# EAGLE design i2c_master_v2 (EAGLE 6.2)
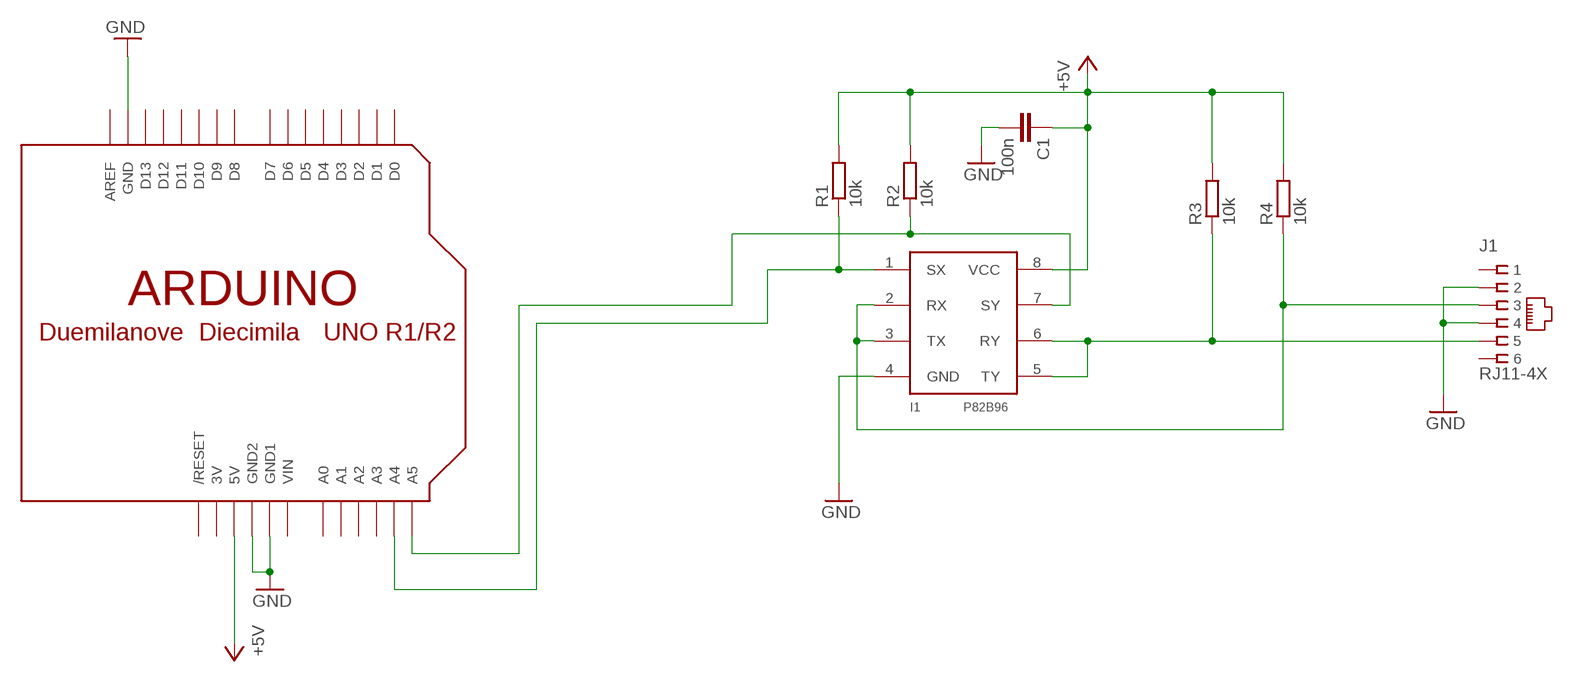
[diagram p0: schematic, sheet 1]

## Parts
C1  100n  C-EUC1206  [C1206]
I1  P82B96  [SOIC8]
J1  RJ11-4X  [RJ11-NO_SHIELD]
R1  10k  R-EU_M1206  [M1206]
R2  10k  R-EU_M1206  [M1206]
R3  10k  R-EU_M1206  [M1206]
R4  10k  R-EU_M1206  [M1206]
U$1  ARDUINO-NOHOLE  [ARDUINO-NOHOLE]

## Nets
+5V: C1.1 I1.8(VCC) R1.2 R2.2 R3.2 R4.2 U$1.5V
GND: C1.2 I1.4(GND) J1.2 J1.4 U$1.GND U$1.GND1 U$1.GND2
N$1: I1.7(SY) R2.1 U$1.A5
N$2: I1.1(SX) R1.1 U$1.A4
N$3: I1.5(TY) I1.6(RY) J1.5 R3.1
N$4: I1.2(RX) I1.3(TX) J1.3 R4.1
Unconnected: J1.1 J1.6 U$1.A0 U$1.A1 U$1.A2 U$1.A3 U$1.AREF U$1.D0 U$1.D1 U$1.D2 U$1.D3 U$1.D4 U$1.D5 U$1.D6 U$1.D7 U$1.D8 U$1.D9 U$1.D10 U$1.D11 U$1.D12 U$1.D13 U$1.RESET(/RESET)

## Power pins joined to a net without a drawn wire
3V: U$1.3V
VIN: U$1.VIN

## Library data of the parts
C1 = resistor:C-EU: CAPACITOR, European symbol
I1 = P82B96:P82B96: P82B96 - I2C buffer
J1 = con-tycoelectronics:RJ11: CORCOM Modular RJ Jacks No Shield Source: www.tycoelectronics.com .. ENG_DS_1654001_1099_RJ_L_0507.pdf; MPN: 6609214-3; OC_FARNELL: unknown; OC_NEWARK: 19R7022
R1-R4 = resistor:R-EU_: RESISTOR, European symbol
U$1 = adafruit:ARDUINO: Arduino Diecimila/Duemilanove Make a shield with ease, this package has all the named pins as well as the two mounting drill holes and an outline of the USB and DC power connector. The outline is on the DIMENSION layer, so if your board house uses it they will cut the outline to match. http://www.ladyada.net/library/pcb/eaglelibrary.html

## Board
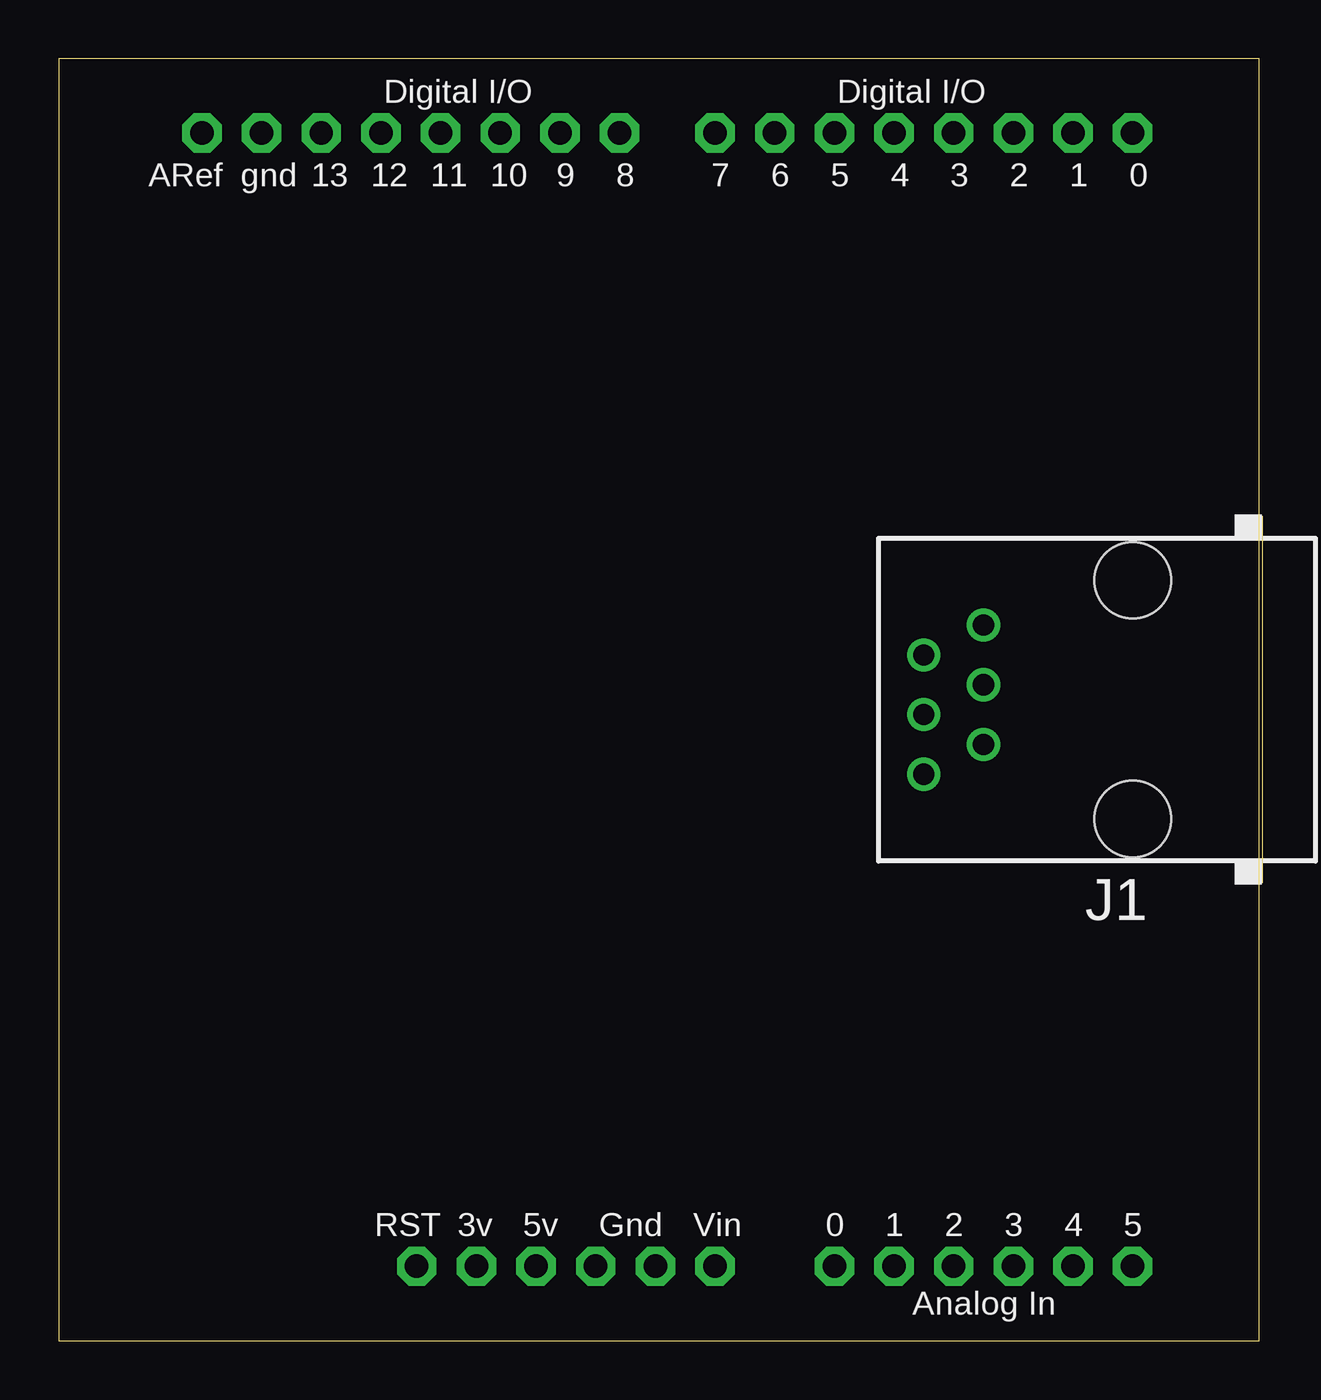
[diagram p1: board, top side]
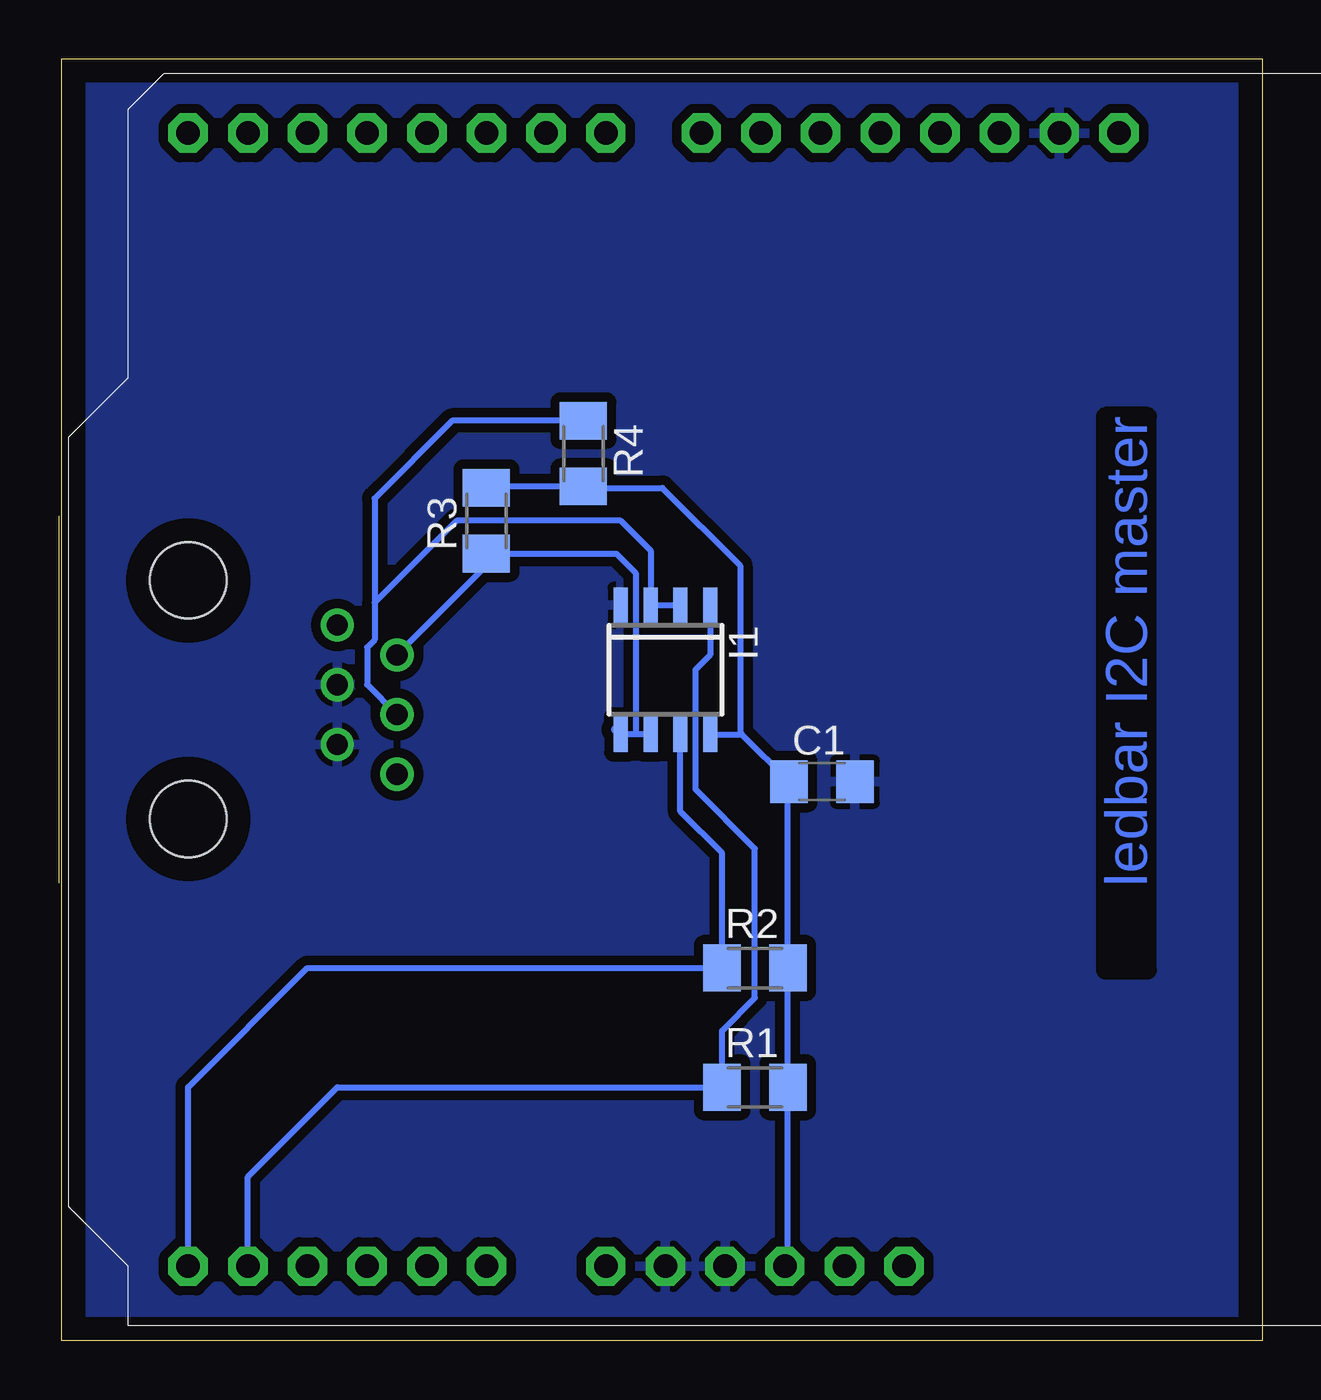
[diagram p2: board, bottom side, seen from below]

Size 51.11 x 54.6 mm. Coordinates in mm from the lower left corner, seen from the top.
Outline: 0,0 51.11,0 51.11,54.6 0,54.6 0,0
Copper layers (1*16): Top 0.035mm / dielectric 1.5mm / Bottom 0.035mm
Design rules: minimum track width 10mil, minimum drill 24mil, track to track 16mil, track to pad 16mil, pad to pad 16mil, via to via 16mil, smd to smd 8mil, copper to edge 40mil, drill to drill 8mil, minimum pad ring 10mil, minimum via ring 8mil, stop-mask expansion 4mil, vias tented up to drill 0mil, thermal gap 10mil

### Footprints (pad centres in the part's own frame; a part is rotated, then mirrored left to right if it is on the bottom)
C1206 = smd 1.6 x 1.8: 1 -1.4,0; 2 1.4,0
SOIC8 = smd 0.6 x 1.5: 1 -1.905,-2.75; 2 -0.635,-2.75; 3 0.635,-2.75; 4 1.905,-2.75; 5 1.905,2.75; 6 0.635,2.75; 7 -0.635,2.75; 8 -1.905,2.75
RJ11-NO_SHIELD = drill 0.9 pad 1.4: 1 -3.175,8.89; 2 -1.905,6.35; 3 -0.635,8.89; 4 0.635,6.35; 5 1.905,8.89; 6 3.175,6.35 | hole 3.251: -5.08,0; 5.08,0
M1206 = smd 1.6 x 2: 1 -1.4,0; 2 1.4,0
ARDUINO-NOHOLE = drill 1 pad 1.676 octagon: 3V 35.56,2.54; 5V 38.1,2.54; A0 50.8,2.54; A1 53.34,2.54; A2 55.88,2.54; A3 58.42,2.54; A4 60.96,2.54; A5 63.5,2.54; AREF 23.876,50.8; D0 63.5,50.8; D1 60.96,50.8; D2 58.42,50.8; D3 55.88,50.8; D4 53.34,50.8; D5 50.8,50.8; D6 48.26,50.8; D7 45.72,50.8; D8 41.656,50.8; D9 39.116,50.8; D10 36.576,50.8; D11 34.036,50.8; D12 31.496,50.8; D13 28.956,50.8; GND 26.416,50.8; GND1 43.18,2.54; GND2 40.64,2.54; RESET 33.02,2.54; VIN 45.72,2.54

### Placement (x,y rotation side)
C1  18.73,23.81 0 bottom
I1  25.4,28.57 180 bottom
J1  45.72,27.3 90 top
R1  21.59,10.79 0 bottom
R2  21.59,15.88 0 bottom
R3  33.02,34.92 90 bottom
R4  28.89,37.78 270 bottom
U$1  -17.78,0.64 0 top

### Tracks (layer width: path | path; a pad name or v marks a point on that pad's centre or on a via)
+5V
  Bottom 0.254: 20.19,3.17 R1.2 R2.2 20.19,23.75 C1.1 22.15,25.82 | R3.2 32.96,36.38 R4.2 28.84,36.32 25.53,36.32 22.23,33.02 22.23,25.9 22.15,25.82 | I1.8 22.15,25.82
  Bottom 0.406: U$1.5V 20.19,3.17
GND
  pour Bottom: -17.78,55.88 55.88,55.88 55.88,-0.95 -17.78,-0.95
N$1
  Bottom 0.254: U$1.A5 45.72,10.79 40.64,15.88 R2.1 22.99,20.77 24.77,22.54 I1.7
N$2
  Bottom 0.254: U$1.A4 43.18,6.99 39.37,10.79 R1.1 22.99,13.21 21.59,14.61 21.59,20.95 24.13,23.49 24.13,28.57 23.5,29.21 I1.1
N$3
  Bottom 0.254: I1.6 26.67,25.82 | 26.67,25.82 I1.5 | 26.67,25.82 26.67,32.7 27.49,33.52 R3.1 33.02,33.02 J1.5
  Bottom 0.406: 27.52,26.04 I1.5
N$4
  Bottom 0.254: I1.3 I1.2 | R4.1 34.48,39.18 37.78,35.88 37.78,31.43 | 37.78,31.43 37.78,29.84 38.1,29.53 38.1,27.94 J1.3 | I1.3 26.03,31.75 | I1.3 26.03,33.66 27.31,34.92 34.29,34.92 37.78,31.43

### Text on the board
Bottom: ledbar I2C master